# Altium project tp2.PrjPcb
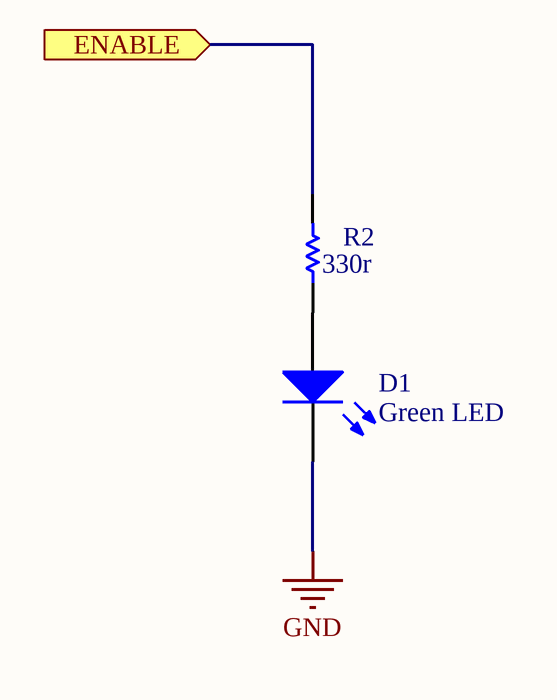
[diagram p0: led.SchDoc]
2 sheets, 15 parts. Net scope: flat (ports and power ports of the same name join across sheets).
Board file: PCB1.PcbDoc
Sheets:
  led.SchDoc
  power.SchDoc

## Sheet led.SchDoc
size A

### Parts
(Parts that share a designator on the sheet are numbered #1, #2 ... from top to bottom, then left to right.)
D1#1  Green LED  [LED-0]
R2  330r  [AXIAL-0.3]

### Ports
ENABLE (in)

### Nets
GND: D1#1.2(K)
NetD1#1_1: D1#1.1(A) R2.1
NetR2_2: R2.2 ; port ENABLE

### Library data of the parts
D1#1 = LED0: Typical INFRARED GaAs LED; Published: 8-Jun-2000; LatestRevisionDate: 08-Jul-2005; LatestRevisionNote: Mech Layer 1 removed.; PackageReference: LED-0; Publisher: Altium Limited; PackageDescription: LED; 2 Leads
R2 = Res1: Resistor; Published: 8-Jun-2000; LatestRevisionDate: 17-Jul-2002; LatestRevisionNote: Re-released for DXP Platform.; PackageReference: AXIAL-0.3; Publisher: Altium Limited; PackageDescription: Axial Device, Thru-Hole; 2 Leads; 0.3 in Pin Spacing; Value: 330r

## Sheet power.SchDoc
size A
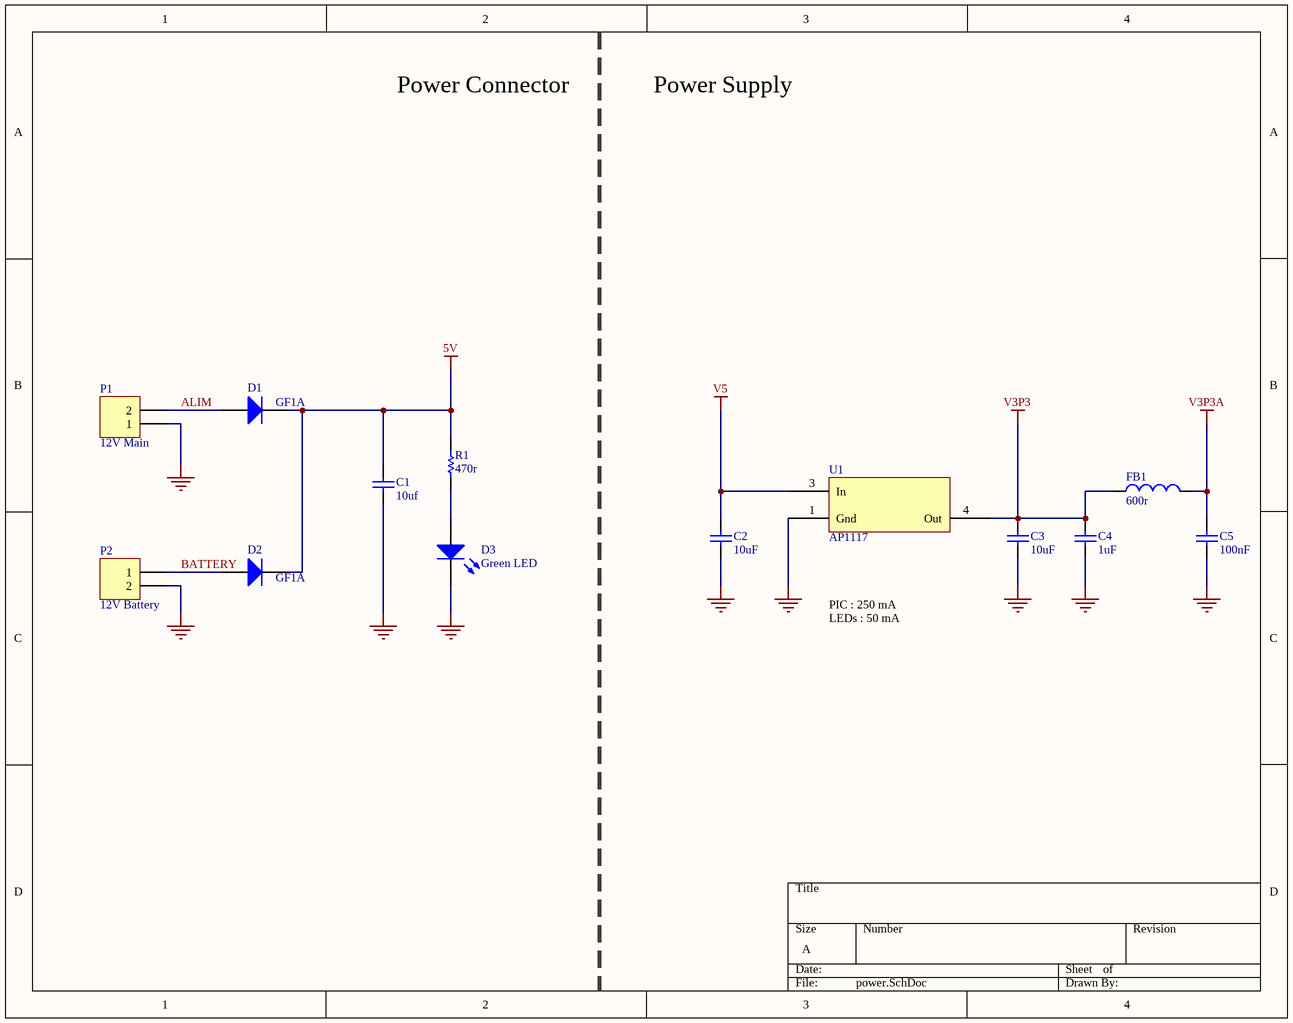
[diagram p1: power.SchDoc]

### Parts
(Parts that share a designator on the sheet are numbered #1, #2 ... from top to bottom, then left to right.)
C1  10uf  [RAD-0.3]
C2  10uF  [RAD-0.3]
C3  10uF  [RAD-0.3]
C4  1uF  [RAD-0.3]
C5  100nF  [RAD-0.3]
D1#2  GF1A  [SMC]
D2  GF1A  [SMC]
D3  Green LED  [LED-0]
FB1  600r  [0402-A]
P1  12V Main  [HDR1X2]
P2  12V Battery  [HDR1X2]
R1  470r  [AXIAL-0.3]
U1  AP1117

### Nets
5V: C1.2 D1#2.2(K) D2.2(K) R1.2
GND: C1.1 C2.1 C3.1 C4.1 C5.1 D3.2(K) P1.1 P2.2 U1.1(Gnd)
V3P3: C3.2 C4.2 FB1.1 U1.4(Out)
V3P3A: C5.2 FB1.2
V5: C2.2 U1.3(In)
ALIM: D1#2.1(A) P1.2
BATTERY: D2.1(A) P2.1
NetD3_1: D3.1(A) R1.1

### Notes on the sheet
- Power Connector
- Power Supply
- PIC : 250 mA
- LEDs : 50 mA

### Library data of the parts
C1-C5 = Cap: Capacitor; Value: 100pF; Published: 8-Jun-2000; LatestRevisionDate: 17-Jul-2002; LatestRevisionNote: Re-released for DXP Platform.; PackageReference: RAD-0.3; Publisher: Altium Limited; PackageDescription: Radial Cap, Thru-Hole; 2 Leads; 0.3 in Pin Spacing
D1#2 D2 = Diode: Default Diode; Published: 8-Jun-2000; LatestRevisionDate: 17-Jul-2002; LatestRevisionNote: Re-released for DXP Platform.; PackageVersion: Sep-1996; PackageReference: SMC; Publisher: Altium Limited; PackageDescription: DO-214-AB/SMC; 2 C-Bend Leads; Body 7.9 x 5.9 mm, inc. leads (LxW); Code_JEDEC: DO-214-AB
D3 = LED0: Typical INFRARED GaAs LED; Published: 8-Jun-2000; LatestRevisionDate: 08-Jul-2005; LatestRevisionNote: Mech Layer 1 removed.; PackageReference: LED-0; Publisher: Altium Limited; PackageDescription: LED; 2 Leads
FB1 = Inductor: Code_IEC: 1005; Value: 10mH; Published: 8-Jun-2000; LatestRevisionDate: 29-May-2009; LatestRevisionNote: IPC-7351 Footprint Added.; PackageReference: 0402-A; Publisher: Altium Limited; PackageDescription: Chip Inductor; Code_JEITA: 0402
P1 P2 = Header 2: Header, 2-Pin; LatestRevisionDate: 17-Jul-2002; LatestRevisionNote: Re-released for DXP Platform.; Publisher: Altium Limited
R1 = Res1: Value: 470k; Published: 8-Jun-2000; LatestRevisionDate: 17-Jul-2002; LatestRevisionNote: Re-released for DXP Platform.; PackageReference: AXIAL-0.3; Publisher: Altium Limited; PackageDescription: Axial Device, Thru-Hole; 2 Leads; 0.3 in Pin Spacing

## Nets that join several sheets
GND: led (D1#1.2), power (9 pins)